# EAGLE design BromoTimer (EAGLE 6.4)
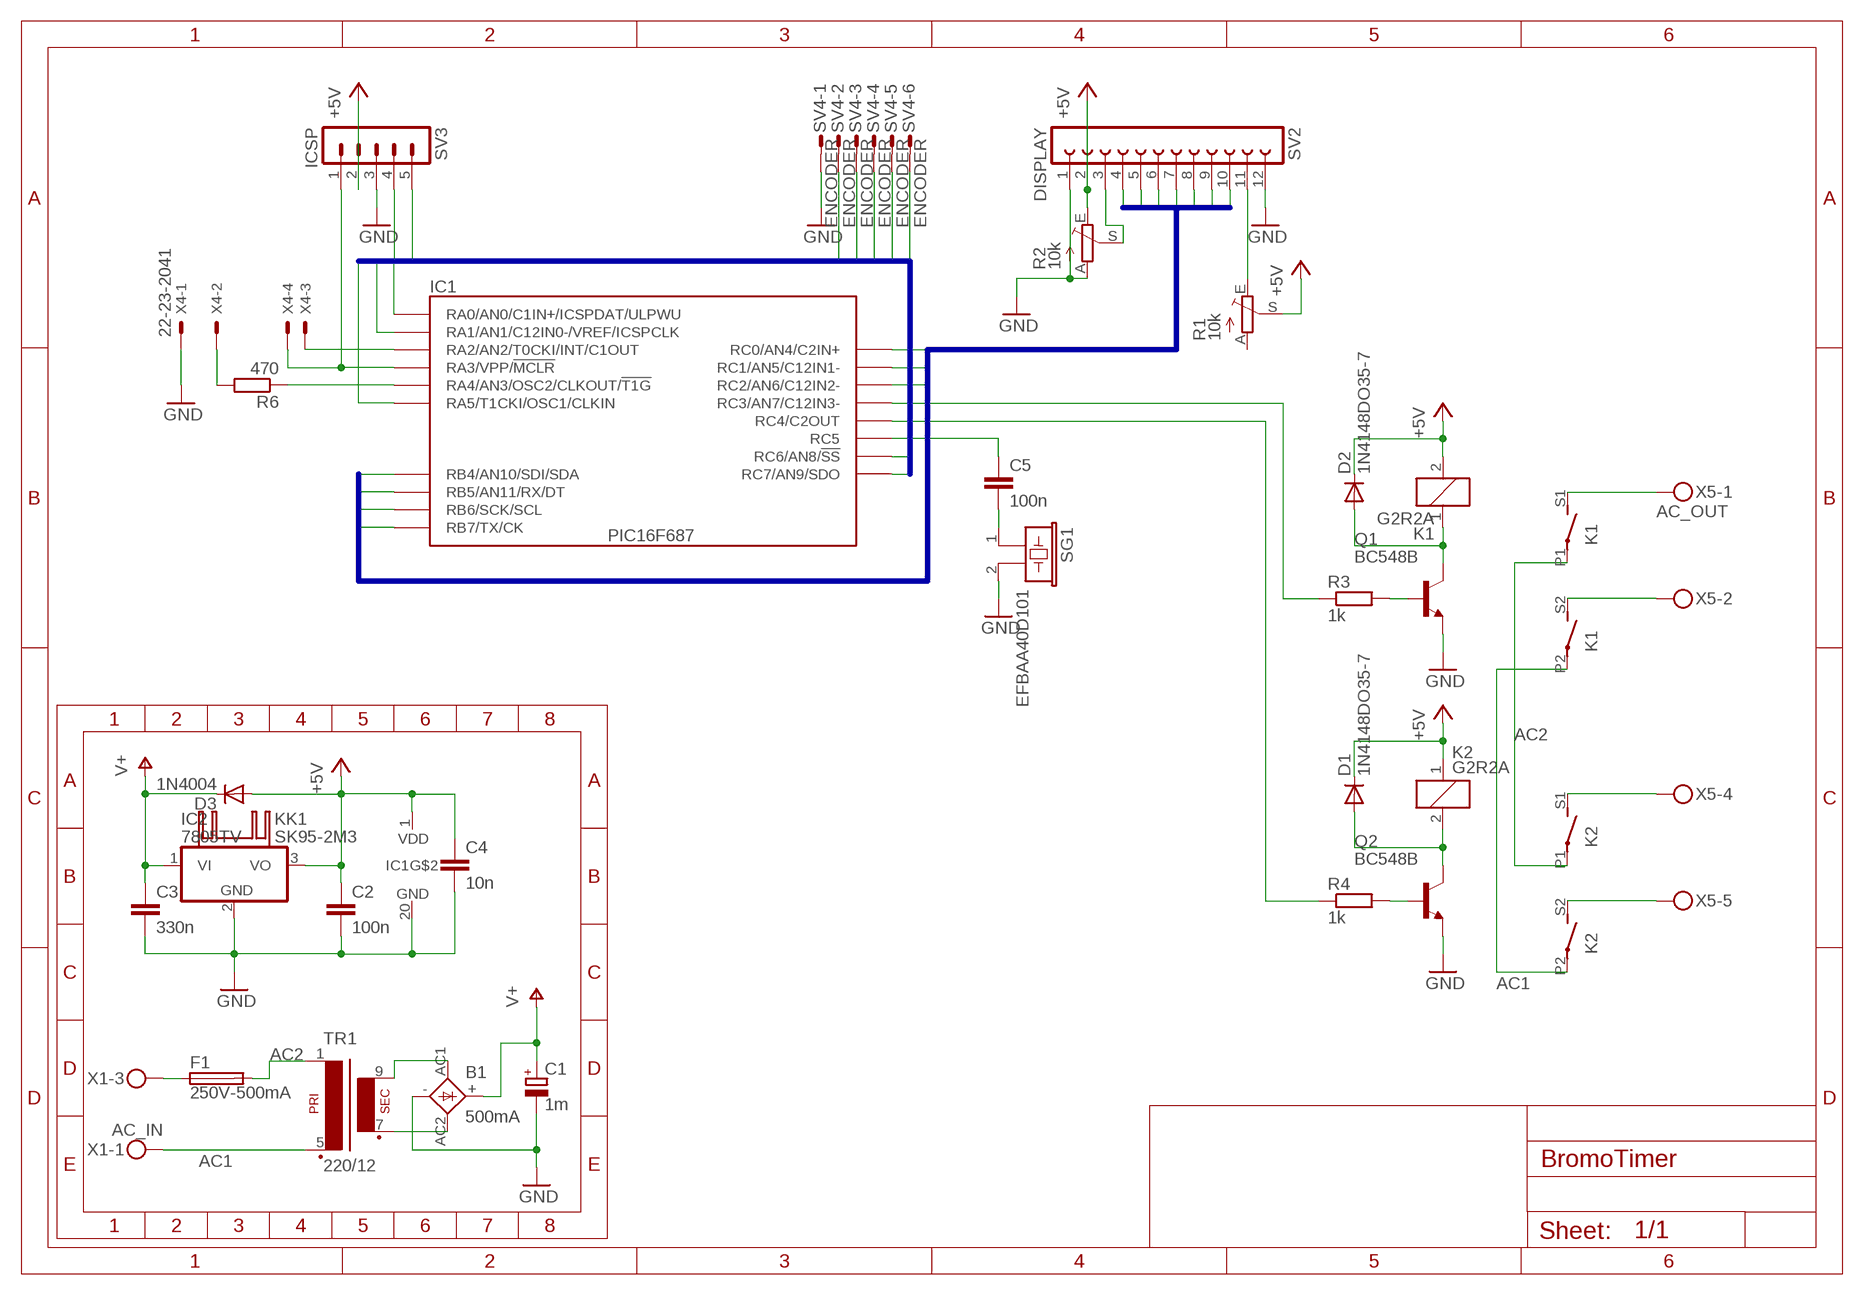
[diagram p0: schematic, sheet 1]

## Parts
B1  500mA  2KBB-R  [2KBB-R]
C1  1m  CPOL-EUE5-13  [E5-13]
C2  100n  C-EU025-024X044  [C025-024X044]
C3  330n  C-EU050-050X075  [C050-050X075]
C4  10n  C-EU025-024X044  [C025-024X044]
C5  100n  C-EU075-032X103  [C075-032X103]
D1  1N4148DO35-7  [DO35-7]
D2  1N4148DO35-7  [DO35-7]
D3  1N4004  [DO41-10]
F1  250V-500mA  SH22  [SH22]
IC1  PIC16F687  [DIP20]
IC2  7805TV  [TO220V]
K1  G2R2A  [G2R2A]
K2  G2R2A  [G2R2A]
KK1  SK95-2M3  [SK95-2M3]
Q1  BC548B  [TO92-EBC]
Q2  BC548B  [TO92-EBC]
R1  10k  TRIM_EU-CA6V  [CA6V]
R2  10k  TRIM_EU-CA6V  [CA6V]
R3  1k  R-EU_0207/7  [0207/7]
R4  1k  R-EU_0207/7  [0207/7]
R6  470  R-EU_0207/7  [0207/7]
SG1  EFBAA40D101  [EFBAA40D101]
SV2  DISPLAY  FE12-1  [FE12]
SV3  ICSP  MA05-1  [MA05-1]
SV4  ENCODER  L06P  [L06P]
TR1  220/12  EI30-1  [EI30-1]
X1  AC_IN  MKDSN1,5/3-5,08  [MKDSN1,5/3-5,08]
X4  22-23-2041  [22-23-2041]
X5  AC_OUT  MKDSN1,5/5-5,08  [MKDSN1,5/5-5,08]

## Nets
+5V [Power]: C2.1 C4.1 D1.C D2.C D3.A IC1.1(VDD) IC2.3(VO) K1.2 K2.1 R1.S R2.E SV2.2 SV3.2
A: IC1.19(RA0/AN0/C1IN+/ICSPDAT/ULPWU) SV3.4 SV4.5
AC1 [240V]: K1.P2(3:P) K2.P2(3:P) TR1.5(P2) X1.1
AC2 [240V]: F1.2 K1.P1(2:P) K2.P1(2:P) TR1.1
B: IC1.18(RA1/AN1/C12IN0-/VREF/ICSPCLK) SV3.5 SV4.6
B0: IC1.13(RB4/AN10/SDI/SDA) SV2.7
B1: IC1.12(RB5/AN11/RX/DT) SV2.8
B2: IC1.11(RB6/SCK/SCL) SV2.9
B3: IC1.10(RB7/TX/CK) SV2.10
EN: IC1.16(RC0/AN4/C2IN+) SV2.6
GND [Power]: B1.- C1.- C2.2 C3.2 C4.2 IC1.20(GND) IC2.2(GND) Q1.E Q2.E R2.A SG1.2 SV2.1 SV2.12 SV3.3 SV4.1 X4.1
LG: IC1.9(RC7/AN9/SDO) SV4.2
LR: IC1.8(RC6/AN8/!SS) SV4.3
N$1: R1.E SV2.11
N$2 [Power]: B1.AC2 TR1.7(S3)
N$3: R2.S SV2.3
N$4: Q2.B R4.2
N$5: Q1.B R3.2
N$6: D1.A K2.2 Q2.C
N$7: D2.A K1.1 Q1.C
N$8 [240V]: K1.S1(2:S) X5.1
N$9 [240V]: K1.S2(3:S) X5.2
N$10 [240V]: K2.S1(2:S) X5.4
N$11 [240V]: K2.S2(3:S) X5.5
N$12 [Power]: B1.AC1 TR1.9(S4)
N$13: IC1.17(RA2/AN2/T0CKI/INT/C1OUT) X4.3
N$14: IC1.6(RC4/C2OUT) R4.1
N$15: IC1.4(RA3/VPP/!MCLR) SV3.1 X4.4
N$16: IC1.7(RC3/AN7/C12IN3-) R3.1
N$17: C5.1 IC1.5(RC5)
N$18: C5.2 SG1.1
N$20: IC1.3(RA4/AN3/OSC2/CLKOUT/!T1G) R6.1
N$21: R6.2 X4.2
N$22 [240V]: F1.1 X1.3
RS: IC1.15(RC1/AN5/C12IN1-) SV2.4
RW: IC1.14(RC2/AN6/C12IN2-) SV2.5
SW: IC1.2(RA5/T1CKI/OSC1/CLKIN) SV4.4
V+ [Power]: B1.+ C1.+ C3.1 D3.C IC2.1(VI)
Unconnected: R1.A X1.2 X5.3

## Buses
RS,RW,EN,B0,B1,B2,B3
LG,LR,SW,A,B

## Library data of the parts
B1 = rectifier:2KBB-R: RECTIFIER grid 3 x 5 mm
C1 = rcl:CPOL-EU: POLARIZED CAPACITOR, European symbol
C2-C5 = rcl:C-EU: CAPACITOR, European symbol
D1 D2 = diode:1N4148: DIODE high speed (Philips)
D3 = diode:1N4004: DIODE general purpose rectifier, 1 A
F1 = fuse:SH22: FUSE HOLDER CS PFP30, Schukat; OC_FARNELL: unknown; OC_NEWARK: unknown
IC1 = g5pwlib:PIC16F687: Microchip PIC16F687 Microcontroller 20-Pin Flash-Based, 8-Bit CMOS Microcontrollers with nanoWatt Technology.
IC2 = linear:78*: Positive VOLTAGE REGULATOR Source: http://cache.national.com/ds/LM/LM78L05.pdf http://www.fairchildsemi.com/ds/LM/LM7805.pdf
K1 K2 = relay:G2R2A: RELAY 2 x norm. open, Omron; MPN: G2R-2A-DC24; OC_FARNELL: 6985269; OC_NEWARK: 36M5257
KK1 = heatsink:SK95-2M3: HEATSINK manufacturer Fischer/distributor Buerklin
Q1 Q2 = transistor-npn:BC548*: NPN Transistor
R1 R2 = pot:TRIM_EU-: POTENTIOMETER
R3 R4 R6 = rcl:R-EU_: RESISTOR, European symbol
SG1 = buzzer:EFB?: Piezoelectric Acoustic Transducer Source: Panbasonic .. 2SC1685.pdf; OC_FARNELL: unknown; OC_NEWARK: unknown
SV2 = con-lsta:FE12-1: FEMALE HEADER; OC_FARNELL: unknown; OC_NEWARK: unknown
SV3 = con-lstb:MA05-1: PIN HEADER; OC_FARNELL: unknown; OC_NEWARK: unknown
SV4 = con-amp-mt:L06P: AMP MT CONNECTOR; OC_FARNELL: unknown; OC_NEWARK: unknown
TR1 = trafo:EI30-1: TRANSFORMER 1 primary winding, 1 secondary winding ERA
X1 = con-phoenix-508:MKDSN1,5/3-5,08: MKDSN 1,5/ 3-5,08 Printklemme Nennstrom: 13,5 A Nennspannung: 250 V Rastermaß: 5,08 mm Polzahl: 3 Anschlussart: Schraubanschluss Montage: Löten Anschlussrichtung Leiter/Platine: 0 ° Artikelnummer: 1729131 Source: http://eshop.phoenixcontact.com .. 1729131.pdf; MPN: SMKDSN1,5/3-5,08; OC_FARNELL: 1792904; OC_NEWARK: 70R0299
X4 = con-molex:22-23-2041: .100" (2.54mm) Center Header - 4 Pin; MF: MOLEX; MPN: 22-23-2041; OC_FARNELL: 1462920; OC_NEWARK: 38C0355
X5 = con-phoenix-508:MKDSN1,5/5-5,08: MKDSN 1,5/ 5-5,08 Printklemme Nennstrom: 13,5 A Nennspannung: 250 V Rastermaß: 5,08 mm Polzahl: 5 Anschlussart: Schraubanschluss Montage: Löten Anschlussrichtung Leiter/Platine: 0 ° Artikelnummer: 1729157 Source: http://eshop.phoenixcontact.com .. 1729157.pdf; MPN: SMKDSN1,5/5-5,08; OC_FARNELL: 1792906; OC_NEWARK: 70R0301

## Net classes
0 default: width 0.305 mm, clearance 0.254 mm
1 240V: width 1.27 mm, clearance 3.81 mm
2 Power: width 0.61 mm, clearance 0.305 mm

## Board
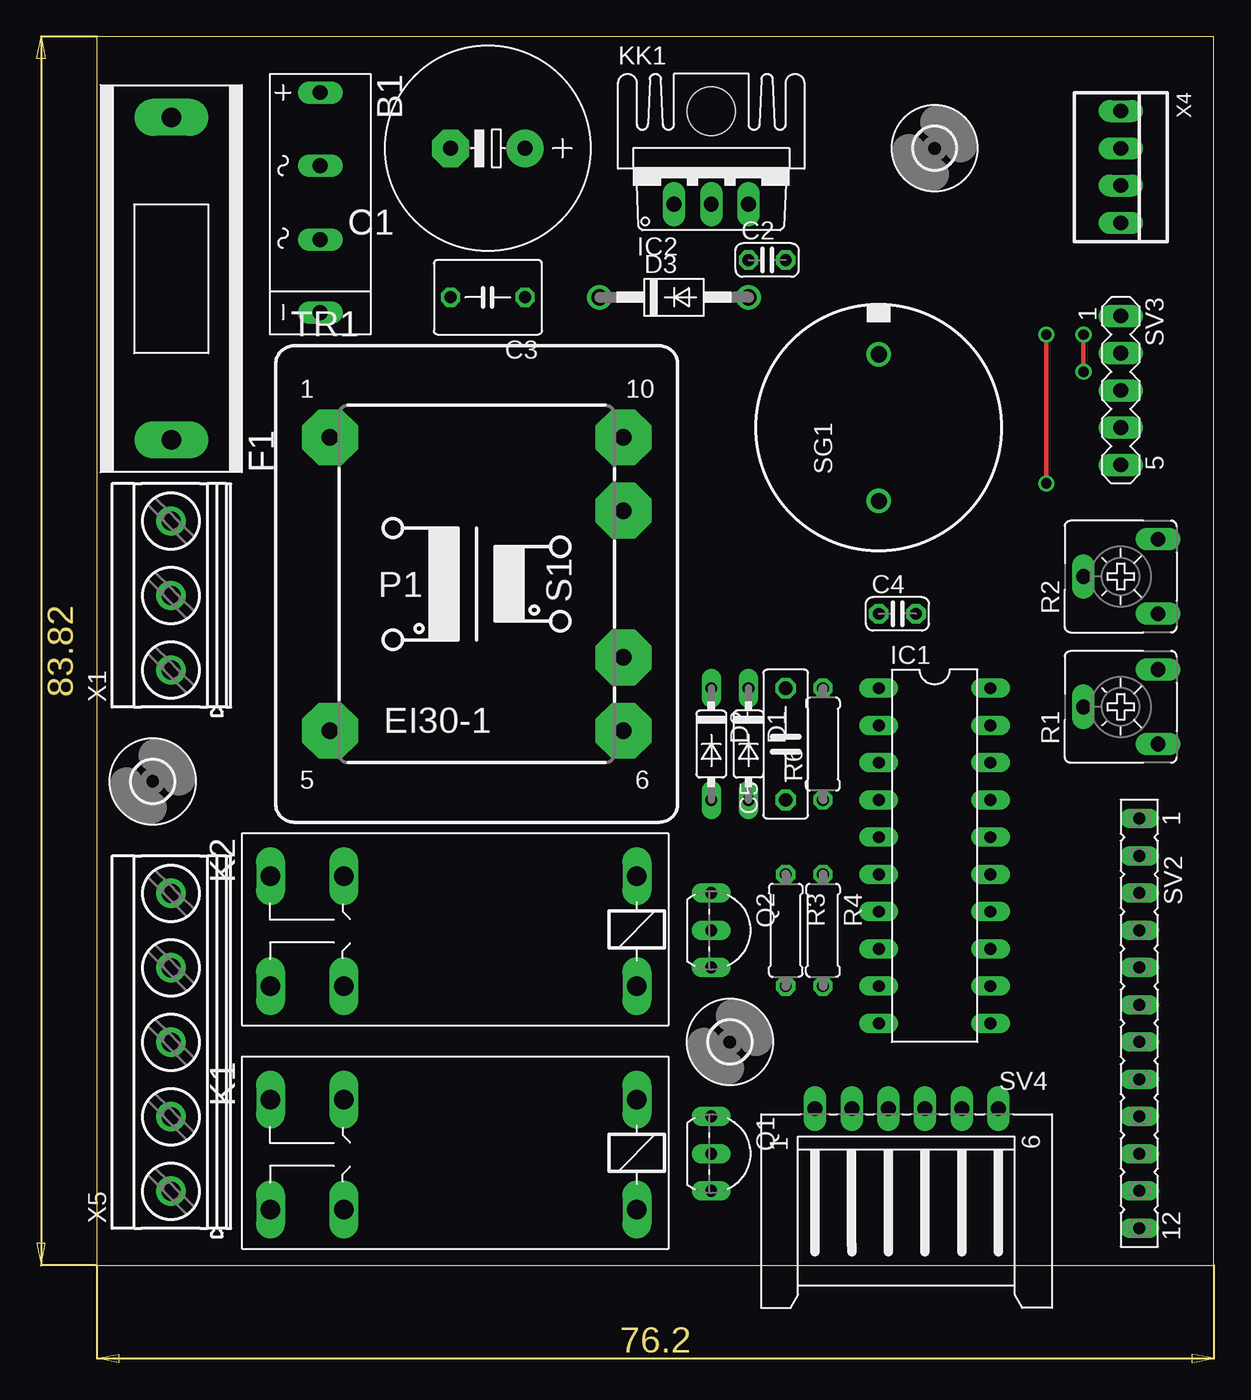
[diagram p1: board, top side]
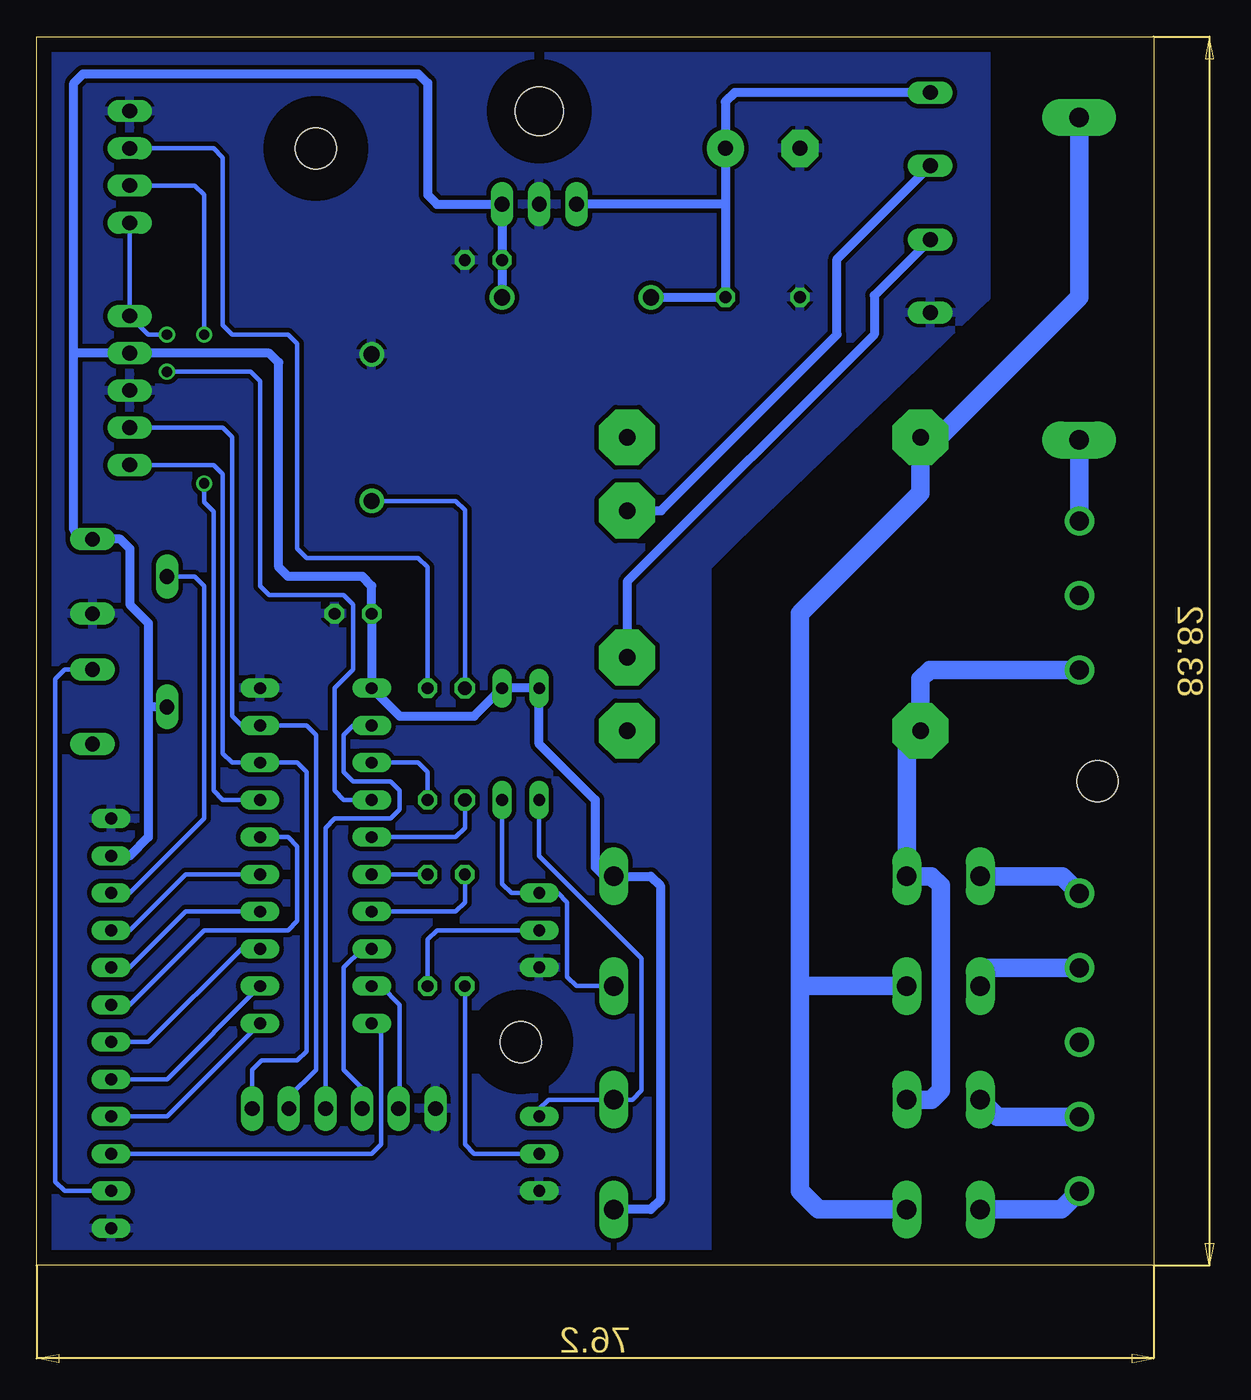
[diagram p2: board, bottom side, seen from below]

Size 76.2 x 83.82 mm. Coordinates in mm from the lower left corner, seen from the top.
Outline: 0,0 76.2,0 76.2,83.82 0,83.82 0,0
Copper layers (1*16): Top 0.035mm / dielectric 1.5mm / Bottom 0.035mm
Design rules "default *": minimum track width 10mil, minimum drill 24mil, track to track 8mil, track to pad 8mil, pad to pad 8mil, via to via 8mil, smd to smd 8mil, copper to edge 40mil, drill to drill 8mil, minimum pad ring 10mil, minimum via ring 8mil, stop-mask expansion 4mil, vias tented up to drill 0mil, thermal gap 10mil

### Footprints (pad centres in the part's own frame; a part is rotated, then mirrored left to right if it is on the bottom)
2KBB-R = drill 1.016 long: + -7.62,0; - 7.391,0; AC1 -2.616,0; AC2 2.413,0
E5-13 = drill 1.016 pad 2.54: + -2.54,0 | drill 1.016 pad 2.54 octagon: - 2.54,0
C025-024X044 = drill 0.813 octagon: 1 -1.27,0; 2 1.27,0
C050-050X075 = drill 0.813 octagon: 1 -2.54,0; 2 2.54,0
C075-032X103 = drill 0.914 octagon: 1 -3.81,0; 2 3.81,0
DO35-7 = drill 0.813 long: A 3.81,0; C -3.81,0
DO41-10 = drill 1.118: A 5.08,0; C -5.08,0
SH22 = drill 1.321 pad 2.54 long: 1 -10.998,0; 2 10.998,0
DIP20 = drill 0.813 long: 1 -11.43,-3.81; 2 -8.89,-3.81; 3 -6.35,-3.81; 4 -3.81,-3.81; 5 -1.27,-3.81; 6 1.27,-3.81; 7 3.81,-3.81; 8 6.35,-3.81; 9 8.89,-3.81; 10 11.43,-3.81; 11 11.43,3.81; 12 8.89,3.81; 13 6.35,3.81; 14 3.81,3.81; 15 1.27,3.81; 16 -1.27,3.81; 17 -3.81,3.81; 18 -6.35,3.81; 19 -8.89,3.81; 20 -11.43,3.81
TO220V = drill 1.016 long: 1 -2.54,-2.54; 2 0,-2.54; 3 2.54,-2.54
G2R2A = drill 1.321 long: 1 -2.54,-3.683; 2 -2.54,3.81; P1 17.45,3.81; P2 17.45,-3.683; S1 22.454,3.81; S2 22.454,-3.683
SK95-2M3 = hole 3.302: 0,2.54
TO92-EBC = drill 0.813 long: B 0,-1.27; C -2.54,-1.27; E 2.54,-1.27
CA6V = drill 1.016 long: A -2.54,-2.54; E 2.54,-2.54; S 0,2.54
0207/7 = drill 0.813 octagon: 1 -3.81,0; 2 3.81,0
EFBAA40D101 = drill 1.1 pad 1.676: 1 -5,0; 2 5,0
FE12 = drill 0.813 long: 1 -13.97,0; 2 -11.43,0; 3 -8.89,0; 4 -6.35,0; 5 -3.81,0; 6 -1.27,0; 7 1.27,0; 8 3.81,0; 9 6.35,0; 10 8.89,0; 11 11.43,0; 12 13.97,0
MA05-1 = drill 1.016 long: 1 -5.08,0; 2 -2.54,0; 3 0,0; 4 2.54,0; 5 5.08,0
L06P = drill 1.016 long: 1 6.25,-6.25; 2 3.75,-6.25; 3 1.25,-6.25; 4 -1.25,-6.25; 5 -3.75,-6.25; 6 -6.25,-6.25
EI30-1 = drill 1.118 pad 3.81 octagon: 1 -10.008,10.008; 5 -10.008,-10.008; 6 10.008,-10.008; 7 10.008,-5.004; 9 10.008,5.004; 10 10.008,10.008
2,8 = hole 2.8: 0,0
MKDSN1,5/3-5,08 = drill 1.3 pad 2: 1 -7.641,0.025; 2 -2.561,0.025; 3 2.519,0.025
22-23-2041 = drill 1 long: 1 -3.81,0; 2 -1.27,0; 3 1.27,0; 4 3.81,0
MKDSN1,5/5-5,08 = drill 1.3 pad 2: 1 -10.181,0.025; 2 -5.101,0.025; 3 -0.021,0.025; 4 5.059,0.025; 5 10.139,0.025

### Placement (x,y rotation side)
B1  15.24,72.39 270 top
C1  26.67,76.2 180 top
C2  45.72,68.58 0 top
C3  26.67,66.04 180 top
C4  54.61,44.45 0 top
C5  46.99,35.56 90 top
D1  44.45,35.56 270 top
D2  41.91,35.56 270 top
D3  39.37,66.04 0 top
F1  5.08,67.31 90 top
IC1  57.15,27.94 270 top
IC2  41.91,74.93 0 top
K1  34.29,7.62 180 top
K2  34.29,22.86 180 top
KK1  41.91,76.2 0 top
Q1  43.18,7.62 270 top
Q2  43.18,22.86 270 top
R1  69.85,38.1 90 top
R2  69.85,46.99 90 top
R3  46.99,22.86 270 top
R4  49.53,22.86 270 top
R6  49.53,35.56 90 top
SG1  53.34,57.15 90 top
SV2  71.12,16.51 270 top
SV3  69.85,59.69 270 top
SV4  55.24,4.45 180 top
TR1  25.91,46.48 0 top
U$2  [2,8]  57.15,76.2 0 top
U$3  [2,8]  43.18,15.24 0 top
U$4  [2,8]  3.81,33.02 0 top
X1  5.08,48.26 90 top
X4  69.85,74.93 270 top
X5  5.08,15.24 90 top

### Tracks (layer width: path | path; a pad name or v marks a point on that pad's centre or on a via)
+5V
  Bottom 0.61: K1.2 34.29,3.81 33.66,4.45 33.66,25.91 34.29,26.54 K2.1 37.47,26.54 38.1,27.18 38.1,31.75 41.91,35.56 D2.C D1.C 46.35,37.47 51.44,37.47 IC1.1 C4.1 53.34,46.35 53.98,46.99 59.05,46.99 59.69,47.62 59.69,61.59 60.33,62.23 SV3.2 73.66,62.23 | SV2.2 69.85,27.94 68.58,29.21 68.58,38.1 | 68.58,38.1 68.58,43.81 69.85,45.09 69.85,48.9 70.48,49.53 R2.E 73.03,49.53 73.66,50.16 73.66,62.23 | R1.S 68.58,38.1 | D3.A C2.1 IC2.3 48.9,72.39 49.53,73.03 49.53,80.64 50.16,81.28 73.03,81.28 73.66,80.64 73.66,62.23
A
  Bottom 0.305: SV3.4 63.5,57.15 62.87,56.52 62.87,37.47 62.23,36.83 IC1.19 57.78,36.83 57.15,36.2 57.15,13.34 58.99,11.49 SV4.5
AC1
  Bottom 1.27: K1.P2 15.16,11.3 14.53,11.94 14.53,25.91 15.16,26.54 K2.P2 16.84,35.53 TR1.5 15.9,39.98 15.27,40.62 X1.1
AC2
  Bottom 1.27: 15.88,57.15 15.88,56.52 TR1.1 | F1.2 5.08,66.04 14.63,56.49 TR1.1 | K1.P1 22.86,3.81 24.13,5.08 24.13,19.05 | K2.P1 24.13,19.05 | TR1.1 15.9,52.68 24.13,44.45 24.13,19.05
B
  Bottom 0.305: SV3.5 64.14,54.61 63.5,53.98 63.5,34.92 62.87,34.29 IC1.18 58.42,34.29 57.78,33.66 57.78,14.61 58.42,13.97 60.86,13.97 61.49,13.34 SV4.6 61.59,10.79
B0
  Bottom 0.305: SV2.7 68.58,15.24 62.23,21.59 IC1.13
B1
  Bottom 0.305: SV2.8 67.31,12.7 IC1.12
B2
  Bottom 0.305: SV2.9 67.31,10.16 IC1.11
B3
  Bottom 0.305: SV2.10 53.34,7.62 52.7,8.26 52.7,15.88 IC1.10
EN
  Bottom 0.305: SV2.6 69.85,17.78 64.77,22.86 59.05,22.86 58.42,23.5 58.42,28.57 59.05,29.21 IC1.16
GND
  pour Bottom: 11.43,85.09 11.43,66.04 28.57,49.53 30.48,47.62 30.48,-1.27 77.47,-1.27 77.47,85.09
LG
  Bottom 0.305: SV4.2 51.44,10.76 51.44,17.78 52.7,19.05 IC1.9
LR
  Bottom 0.305: SV4.3 53.99,12.09 55.24,13.34 55.24,20.32 53.98,21.59 IC1.8
N$1
  Bottom 0.305: SV2.11 74.3,5.08 74.93,5.71 74.93,40.01 74.3,40.64 R1.E
N$2
  Bottom 0.61: B1.AC2 19.05,66.17 19.05,63.5 35.92,46.63 TR1.7
N$3
  Bottom 0.305: R2.S 65.41,46.99 64.77,46.35 64.77,30.48 69.85,25.4 SV2.3
N$4
  Bottom 0.305: Q2.B 48.9,22.86 49.53,22.23 R4.2
N$5
  Bottom 0.305: R3.2 46.99,8.26 46.35,7.62 Q1.B
N$6
  Bottom 0.305: K2.2 39.37,19.05 40.01,19.68 40.01,24.77 40.64,25.4 Q2.C 43.81,25.4 44.45,26.04 D1.A
N$7
  Bottom 0.305: D2.A 41.91,27.94 34.92,20.95 34.92,11.94 35.56,11.3 K1.1 41.27,11.3 41.91,10.67 Q1.C
N$8
  Bottom 1.27: X5.1 6.3,3.81 K1.S1
N$9
  Bottom 1.27: K1.S2 10.67,10.14 X5.2
N$10
  Bottom 1.27: X5.4 11.2,20.3 11.84,19.66 K2.S1
N$11
  Bottom 1.27: X5.5 6.22,26.54 K2.S2
N$12
  Bottom 0.61: TR1.9 33.6,51.49 21.59,63.5 21.59,68.66 B1.AC1
N$13  (via drill 0.7)
  Top 0.305: v64.77,63.5 v64.77,53.34
  Bottom 0.305: IC1.17 63.5,31.75 64.14,32.38 64.14,51.44 64.77,52.07 v64.77,53.34 | v64.77,63.5 64.77,73.03 65.41,73.66 X4.3
N$14
  Bottom 0.305: R4.1 IC1.6
N$15  (via drill 0.7)
  Top 0.305: v67.31,60.96 v67.31,63.5
  Bottom 0.305: X4.4 SV3.1 68.58,63.5 v67.31,63.5 | v67.31,60.96 61.59,60.96 60.96,60.33 60.96,46.35 60.33,45.72 55.24,45.72 54.61,45.09 54.61,40.64 55.88,39.37 55.88,32.38 55.24,31.75 IC1.4
N$16
  Bottom 0.305: R3.1 46.99,24.77 47.62,24.13 IC1.7
N$17
  Bottom 0.305: C5.1 46.99,29.84 47.62,29.21 IC1.5
N$18
  Bottom 0.305: C5.2 46.99,51.52 47.62,52.15 SG1.1
N$20
  Bottom 0.305: IC1.3 50.16,34.29 49.53,33.66 R6.1
N$21
  Bottom 0.305: R6.2 49.53,47.62 50.16,48.26 57.78,48.26 58.42,48.9 58.42,62.87 59.05,63.5 62.87,63.5 63.5,64.14 63.5,75.56 64.14,76.2 X4.2
N$22
  Bottom 1.27: F1.1 5.05,56.29 X1.3
RS
  Bottom 0.305: SV2.4 69.85,22.86 66.04,26.67 IC1.15
RW
  Bottom 0.305: SV2.5 69.85,20.32 66.04,24.13 IC1.14
SW
  Bottom 0.305: 56.52,10.71 SV4.4 56.49,29.84 55.86,30.48 52.07,30.48 51.44,31.11 51.44,32.38 52.07,33.02 54.61,33.02 55.24,33.66 55.24,36.2 54.61,36.83 IC1.2
V+
  Bottom 0.61: B1.+ 28.57,80.01 29.21,79.38 C1.+ 29.21,72.39 | 29.21,72.39 IC2.1 | D3.C C3.1 29.21,72.39